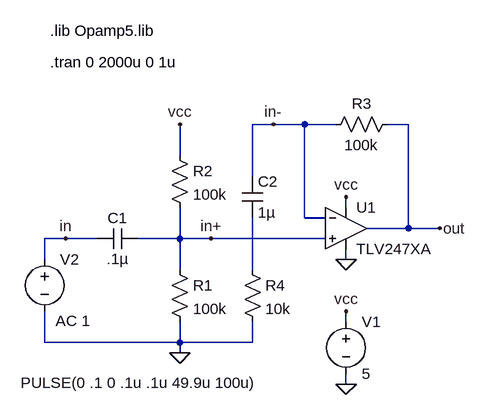
[diagram p0: schematic TLV347x_test.asc]
TLV347x_test.asc, the LTspice schematic file:
Version 4
SHEET 1 880 680
WIRE 80 16 48 16
WIRE 128 16 80 16
WIRE 176 16 128 16
WIRE 288 16 256 16
WIRE -64 64 -64 16
WIRE 48 96 48 16
WIRE 192 144 192 128
WIRE 128 160 128 16
WIRE 160 160 128 160
WIRE 288 176 288 16
WIRE 288 176 224 176
WIRE 336 176 288 176
WIRE -240 192 -272 192
WIRE -192 192 -240 192
WIRE -64 192 -64 144
WIRE -64 192 -128 192
WIRE -16 192 -64 192
WIRE 160 192 -16 192
WIRE -272 224 -272 192
WIRE 192 224 192 208
WIRE -64 240 -64 192
WIRE 48 240 48 160
WIRE 192 320 192 304
WIRE -272 352 -272 304
WIRE -64 352 -64 320
WIRE -64 352 -272 352
WIRE 48 352 48 320
WIRE 48 352 -64 352
WIRE -64 368 -64 352
WIRE 192 416 192 400
FLAG 192 416 0
FLAG 192 304 vcc
FLAG 192 128 vcc
FLAG 192 224 0
FLAG -64 368 0
FLAG -64 16 vcc
FLAG 336 176 out
FLAG -240 192 in
FLAG -16 192 in+
FLAG 80 16 in-
SYMBOL Opamps\\opamp2 192 112 R0
SYMATTR InstName U1
SYMATTR Value TLV247XA
SYMBOL voltage 192 304 R0
SYMATTR InstName V1
SYMATTR Value 5
SYMBOL res -80 224 R0
SYMATTR InstName R1
SYMATTR Value 100k
SYMBOL res -80 48 R0
SYMATTR InstName R2
SYMATTR Value 100k
SYMBOL res 160 32 R270
WINDOW 0 32 56 VTop 0
WINDOW 3 0 56 VBottom 0
SYMATTR InstName R3
SYMATTR Value 100k
SYMBOL res 32 224 R0
SYMATTR InstName R4
SYMATTR Value 10k
SYMBOL cap -192 208 R270
WINDOW 0 32 32 VTop 0
WINDOW 3 0 32 VBottom 0
SYMATTR InstName C1
SYMATTR Value .1µ
SYMBOL cap 32 96 R0
SYMATTR InstName C2
SYMATTR Value 1µ
SYMBOL voltage -272 208 R0
WINDOW 3 -37 206 Left 0
WINDOW 123 17 111 Left 0
WINDOW 39 0 0 Left 0
SYMATTR Value PULSE(0 .1 0 .1u .1u 49.9u 100u)
SYMATTR Value2 AC 1
SYMATTR InstName V2
TEXT -264 -128 Left 0 !.lib Opamp5.lib
TEXT -264 -80 Left 0 !.tran 0 2000u 0 1u

The netlist it stands for:
* TLV347x_test.asc
XU1 in+ in- vcc 0 out TLV247XA  ; pins In+ In- V+ V- OUT
V1 vcc 0 5
R1 in+ 0 100k
R2 vcc in+ 100k
R3 in- out 100k
R4 N001 0 10k
C1 in in+ .1µ
C2 in- N001 1µ
V2 in 0 PULSE(0 .1 0 .1u .1u 49.9u 100u) AC 1
.lib Opamp5.lib
.tran 0 2000u 0 1u
.backanno
.end